# Altium schematic sheet Servo Control Board.SchDoc
size A4
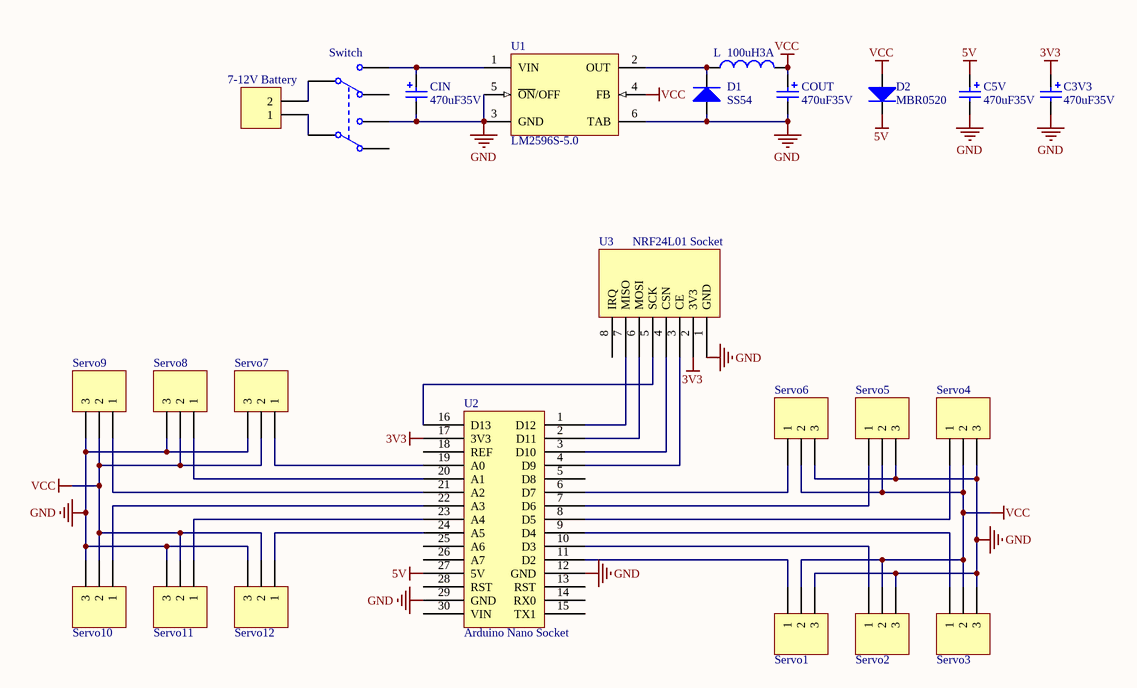
[diagram p0: Servo Control Board.SchDoc]

## Parts
7-12V_Battery  Header 2  [KF301-2P]  (value not drawn)
C3V3  value 470uF35V  [cp10x10]  (hidden comment: Cap Pol)
C5V  value 470uF35V  [cp10x10]  (hidden comment: Cap Pol)
CIN  value 470uF35V  [cp10x10]  (hidden comment: Cap Pol)
COUT  value 470uF35V  [cp10x10]  (hidden comment: Cap Pol)
D1  SS54  [SS54]
D2  MBR0520  [SOD-123]
L  value 100uH3A  [Inductor 14.6x6.8x0.8]  (hidden comment: Inductor)
Servo1  Header 3  [Header 3]  (value not drawn)
Servo2  Header 3  [Header 3]  (value not drawn)
Servo3  Header 3  [Header 3]  (value not drawn)
Servo4  Header 3  [Header 3]  (value not drawn)
Servo5  Header 3  [Header 3]  (value not drawn)
Servo6  Header 3  [Header 3]  (value not drawn)
Servo7  Header 3  [Header 3]  (value not drawn)
Servo8  Header 3  [Header 3]  (value not drawn)
Servo9  Header 3  [Header 3]  (value not drawn)
Servo10  Header 3  [Header 3]  (value not drawn)
Servo11  Header 3  [Header 3]  (value not drawn)
Servo12  Header 3  [Header 3]  (value not drawn)
Switch  Push Switch  [Push Switch 7x7]  (value not drawn)
U1  LM2596S-5.0  [TS5B_N]
U2  Arduino Nano Socket  [arduino nano socket]
U3  NRF24L01 Socket  [nrf24l01 socket]

## Nets
3V3: C3V3.1 U2.17(3V3) U3.2(3V3)
5V: C5V.1 D2.2(K) U2.27(5V)
GND: C3V3.2 C5V.2 CIN.2 COUT.2 D1.1(A) Servo1.3 Servo2.3 Servo3.3 Servo4.3 Servo5.3 Servo6.3 Servo7.3 Servo8.3 Servo9.3 Servo10.3 Servo11.3 Servo12.3 Switch.3(NO1) U1.3(GND) U1.5(~{ON}/OFF) U1.6(TAB) U2.12(GND) U2.29(GND) U3.1(GND)
VCC: COUT.1 D2.1(A) L.2 Servo1.2 Servo2.2 Servo3.2 Servo4.2 Servo5.2 Servo6.2 Servo7.2 Servo8.2 Servo9.2 Servo10.2 Servo11.2 Servo12.2 U1.4(FB)
Net7-12V_Battery_1: 7-12V_Battery.1 Switch.1(COMMON1)
Net7-12V_Battery_2: 7-12V_Battery.2 Switch.4(COMMON2)
NetCIN_1: CIN.1 Switch.6(NO2) U1.1(VIN)
NetD1_2: D1.2(K) L.1 U1.2(OUT)
NetServo1_1: Servo1.1 U2.11(D2)
NetServo2_1: Servo2.1 U2.10(D3)
NetServo3_1: Servo3.1 U2.9(D4)
NetServo4_1: Servo4.1 U2.8(D5)
NetServo5_1: Servo5.1 U2.7(D6)
NetServo6_1: Servo6.1 U2.6(D7)
NetServo7_1: Servo7.1 U2.19(A0)
NetServo8_1: Servo8.1 U2.20(A1)
NetServo9_1: Servo9.1 U2.21(A2)
NetServo10_1: Servo10.1 U2.22(A3)
NetServo11_1: Servo11.1 U2.23(A4)
NetServo12_1: Servo12.1 U2.24(A5)
NetU2_1: U2.1(D12) U3.7(MISO)
NetU2_2: U2.2(D11) U3.6(MOSI)
NetU2_3: U2.3(D10) U3.4(CSN)
NetU2_4: U2.4(D9) U3.3(CE)
NetU2_16: U2.16(D13) U3.5(SCK)

Not connected (* = marked no-connect by the designer): Switch 2(NC1) 5(NC2); U2 5(D8) 13(RST) 14(RX0) 15(TX1) 18(REF) 25(A6) 26(A7) 28(RST) 30(VIN); U3 8(IRQ)

## Library data of the parts
D1 D2 = Diode
U1 = LM2596S-5.0: SIMPLE SWITCHER Power Converter 150 KHz 3A Step-Down Voltage Regulator; Manufacturer: National Semiconductor; PackageTopMarking: NSUZXYTT*LM2596S*-5.0 P+; PowerWise: N; FirstPublished: 4-Dec-2008; DatasheetVersion: May-2002; PackageVersion: revD, Apr-2005; PackageReference: TS5B; Publisher: Altium Limited; PackageDescription: TO-263, Molded, .400 x .390 x .180in, 5 Lead, .067in Pitch, Surface Mount; CompType: Switcher; PartNumber: LM2596S-5.0; RoHS: O; PinCount: 5; DigiKeyPartNumber: LM2596S-5.0-ND; Code_JEDEC: MO-169-AB; ComponentLink1Description: LM2596 Datasheet; ComponentLink1URL: http://www.national.com/ds/LM/LM2596.pdf; ComponentLink2Description: LM2596 Web Page; ComponentLink2URL: http://www.national.com/pf/LM/LM2596.html; ComponentLink3Description: TS5B Package Page; ComponentLink3URL: http://www.national.com/packaging/folders/ts5b.html